# EAGLE design isoamp (EAGLE 9.6.2)
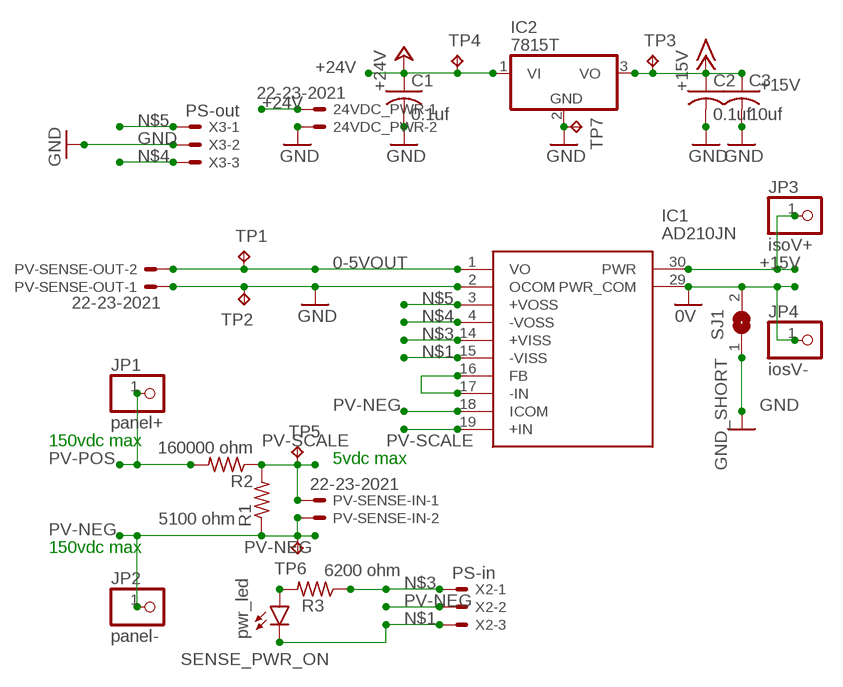
[diagram p0: schematic, sheet 1]

## Parts
24VDC_PWR  22-23-2021  [22-23-2021]
C1  0.1uf  C-USC1206  [C1206]
C2  0.1uf  C-USC1206  [C1206]
C3  10uf  C-USC1206  [C1206]
IC1  AD210JN  [AD210_N_12]
IC2  7815T  [TO220H]
JP1  panel+  PINHD-1X1  [1X01]
JP2  panel-  PINHD-1X1  [1X01]
JP3  isoV+  PINHD-1X1  [1X01]
JP4  iosV-  PINHD-1X1  [1X01]
PV-SENSE-IN  22-23-2021  [22-23-2021]
PV-SENSE-OUT  22-23-2021  [22-23-2021]
R1  5100 ohm  R-US_M1206  [M1206]
R2  160000 ohm  R-US_0204/7  [0204/7]
R3  6200 ohm  R-US_M1206  [M1206]
SENSE_PWR_ON  pwr_led  LEDCHIPLED_1206  [CHIPLED_1206]
SJ1  GND_SHORT  SJW  [SJW]
TP1  TPPAD1-13  [P1-13]
TP2  TPPAD1-13  [P1-13]
TP3  TPPAD1-13  [P1-13]
TP4  TPPAD1-13  [P1-13]
TP5  TPPAD1-13  [P1-13]
TP6  TPPAD1-13  [P1-13]
TP7  TPPAD1-13  [P1-13]
X2  PS-in  22-23-2031  [22-23-2031]
X3  PS-out  22-23-2031  [22-23-2031]

## Nets
0-5VOUT: IC1.1(VO) PV-SENSE-OUT.2 TP1.TP
0V: IC1.29(PWR_COM) JP4.1 SJ1.2
+15V: C2.1 C3.1 IC1.30(PWR) IC2.3(VO) JP3.1 TP3.TP
+24V: 24VDC_PWR.1 C1.1 IC2.1(VI) TP4.TP
GND: 24VDC_PWR.2 C1.2 C2.2 C3.2 IC1.2(OCOM) IC2.2(GND) PV-SENSE-OUT.1 SJ1.1 TP2.TP TP7.TP X3.2
N$1: IC1.15(-VISS) SENSE_PWR_ON.C X2.3
N$2: IC1.16(FB) IC1.17(-IN)
N$3: IC1.14(+VISS) R3.1 X2.1
N$4: IC1.4(-VOSS) X3.3
N$5: IC1.3(+VOSS) X3.1
N$6: R3.2 SENSE_PWR_ON.A
PV-NEG: IC1.18(ICOM) JP2.1 PV-SENSE-IN.2 R1.1 TP6.TP X2.2
PV-POS: JP1.1 R2.2
PV-SCALE: IC1.19(+IN) PV-SENSE-IN.1 R1.2 R2.1 TP5.TP

## Notes on the sheet
- 150vdc max
- 5vdc max
- 150vdc max

## Library data of the parts
24VDC_PWR PV-SENSE-IN PV-SENSE-OUT = con-molex:22-23-2021: .100" (2.54mm) Center Header - 2 Pin; MF: MOLEX; MPN: 22-23-2021; OC_FARNELL: 1462926; OC_NEWARK: 25C3832
C1-C3 = rcl:C-US: CAPACITOR, American symbol; SPICEPREFIX: C
IC1 = AD210JN:AD210JN: Precision, Wide Bandwidth 3-Port Isolation Amplifier Source: Datasheet; DESCRIPTION: Precision, Wide Bandwidth 3-Port Isolation Amplifier; HEIGHT: mm; MANUFACTURER_NAME: Analog Devices; MANUFACTURER_PART_NUMBER: AD210JN; MOUSER_PART_NUMBER: 584-AD210JN; MOUSER_PRICE-STOCK: https://www.mouser.co.uk/ProductDetail/Analog-Devices/AD210JN?qs=NmRFExCfTkFa6nj1j%252BgrMw%3D%3D
IC2 = linear:78*: Positive VOLTAGE REGULATOR Source: http://cache.national.com/ds/LM/LM78L05.pdf http://www.fairchildsemi.com/ds/LM/LM7805.pdf
JP1-JP4 = pinhead:PINHD-1X1: PIN HEADER
R1-R3 = rcl:R-US_: RESISTOR, American symbol; SPICEPREFIX: R
SENSE_PWR_ON = led:LED: LED OSRAM: - CHIPLED LG R971, LG N971, LY N971, LG Q971, LY Q971, LO R971, LY R971 LH N974, LH R974 LS Q976, LO Q976, LY Q976 LO Q996 - Hyper CHIPLED LW Q18S LB Q993, LB Q99A, LB R99A - SideLED LS A670, LO A670, LY A670, LG A670, LP A670 LB A673, LV A673, LT A673, LW A673 LH A674 LY A675 LS A676, LA A676, LO A676, LY A676, LW A676 LS A679, LY A679, LG A679 - Hyper Micro SIDELED® LS Y876, LA Y876, LO Y876, LY Y876 LT Y87S - SmartLED LW L88C, LW L88S LB L89C, LB L89S, LG L890 LS L89K, LO L89K, LY L89K LS L896, LA L896, LO L896, LY L896 - TOPLED LS T670, LO T670, LY T670, LG T670, LP T670 LSG T670, LSP T670, LSY T670, LOP T670, LYG T670 LG T671, LOG T671, LSG T671 LB T673, LV T673, LT T673, LW T673 LH T674 LS T676, LA T676, LO T676, LY T676, LB T676, LH T676, LSB T676, LW T676 LB T67C, LV T67C, LT T67C, LS T67K, LO T67K, LY T67K, LW E67C LS E67B, LA E67B, LO E67B, LY E67B, LB E67C, LV E67C, LT E67C LW T67C LS T679, LY T679, LG T679 LS T770, LO T770, LY T770, LG T770, LP T770 LB T773, LV T773, LT T773, LW T773 LH T774 LS E675, LA E675, LY E675, LS T675 LS T776, LA T776, LO T776, LY T776, LB T776 LHGB T686 LT T68C, LB T68C - Hyper Mini TOPLED® LB M676 - Mini TOPLED Santana® LG M470 LS M47K, LO M47K, LY M47K Source: http://www.osram.convergy.de LUXEON: - LUMILED® LXK2-PW12-R00, LXK2-PW12-S00, LXK2-PW14-U00, LXK2-PW14-V00 LXK2-PM12-R00, LXK2-PM12-S00, LXK2-PM14-U00 LXK2-PE12-Q00, LXK2-PE12-R00, LXK2-PE12-S00, LXK2-PE14-T00, LXK2-PE14-U00 LXK2-PB12-K00, LXK2-PB12-L00, LXK2-PB12-M00, LXK2-PB14-N00, LXK2-PB14-P00, LXK2-PB14-Q00 LXK2-PR12-L00, LXK2-PR12-M00, LXK2-PR14-Q00, LXK2-PR14-R00 LXK2-PD12-Q00, LXK2-PD12-R00, LXK2-PD12-S00 LXK2-PH12-R00, LXK2-PH12-S00 LXK2-PL12-P00, LXK2-PL12-Q00, LXK2-PL12-R00 Source: www.luxeon.com KINGBRIGHT: KA-3528ASYC Source: www.kingbright.com
SJ1 = jumper:SJ: SMD solder JUMPER
TP1-TP7 = testpad:TP: Test pad
X2 X3 = con-molex:22-23-2031: .100" (2.54mm) Center Header - 3 Pin; MF: MOLEX; MPN: 22-23-2031; OC_FARNELL: 1462950; OC_NEWARK: 30C0862

## Net classes
0 default: width 0.508 mm

## Board
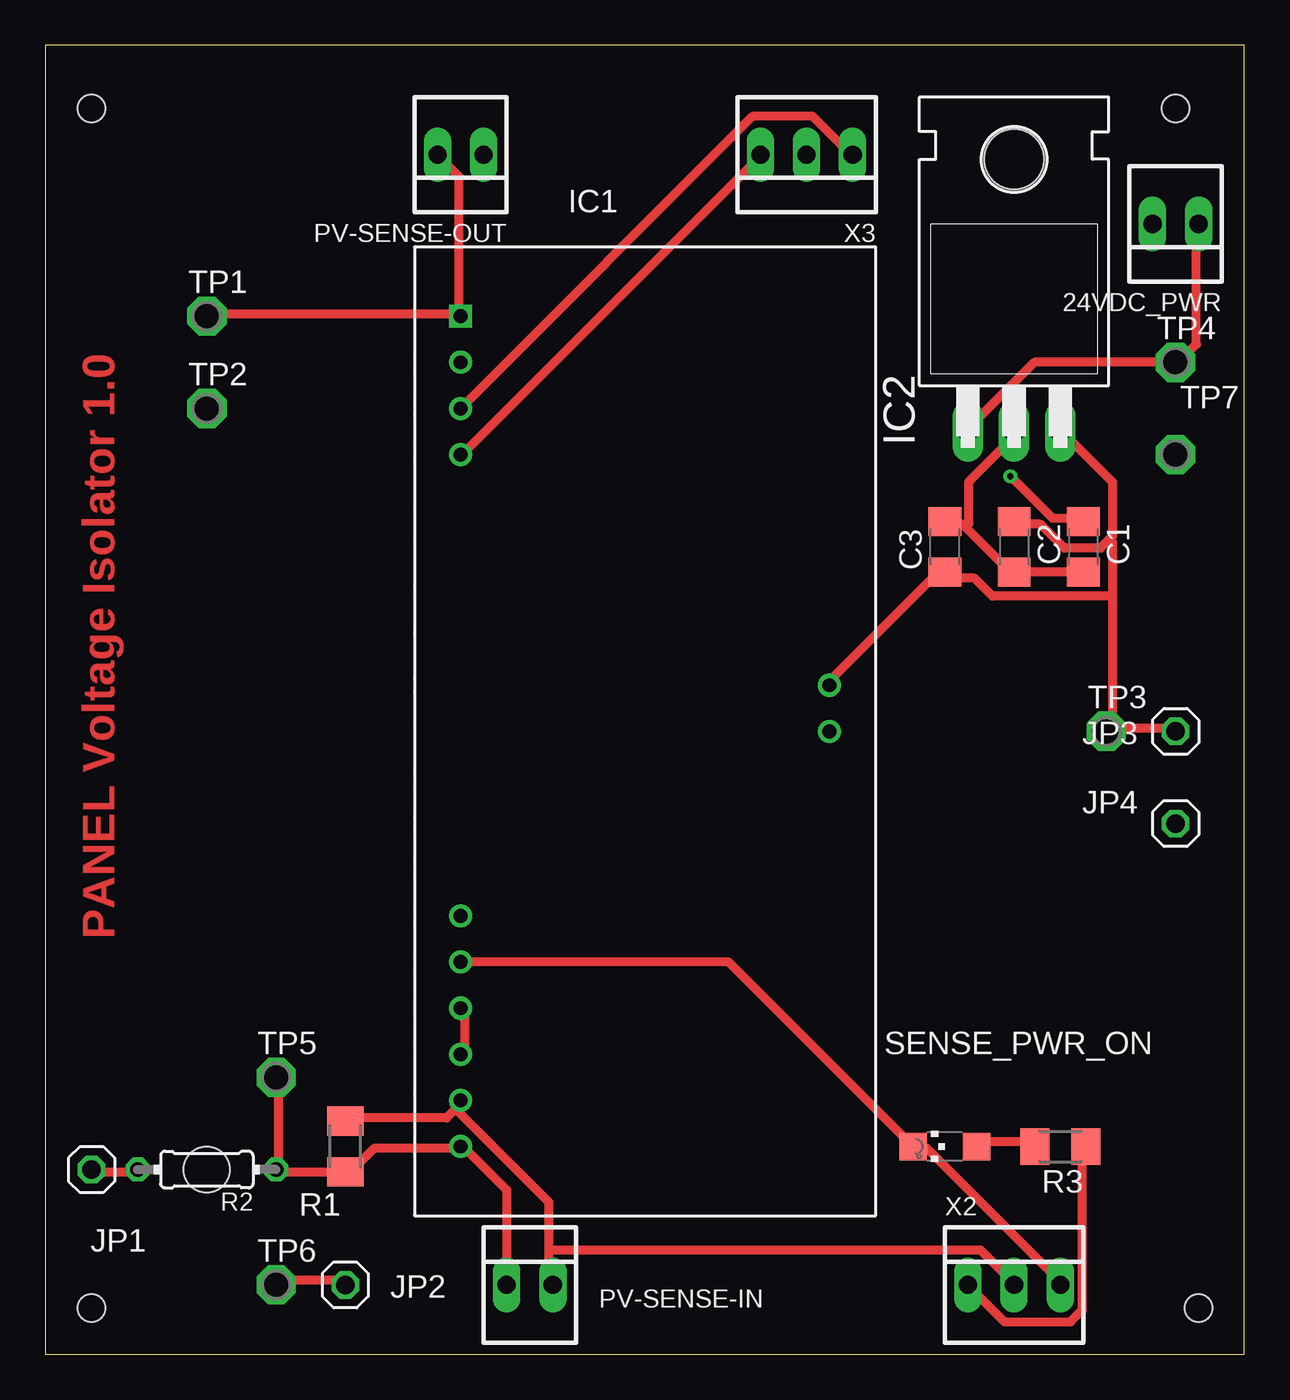
[diagram p1: board, top side]
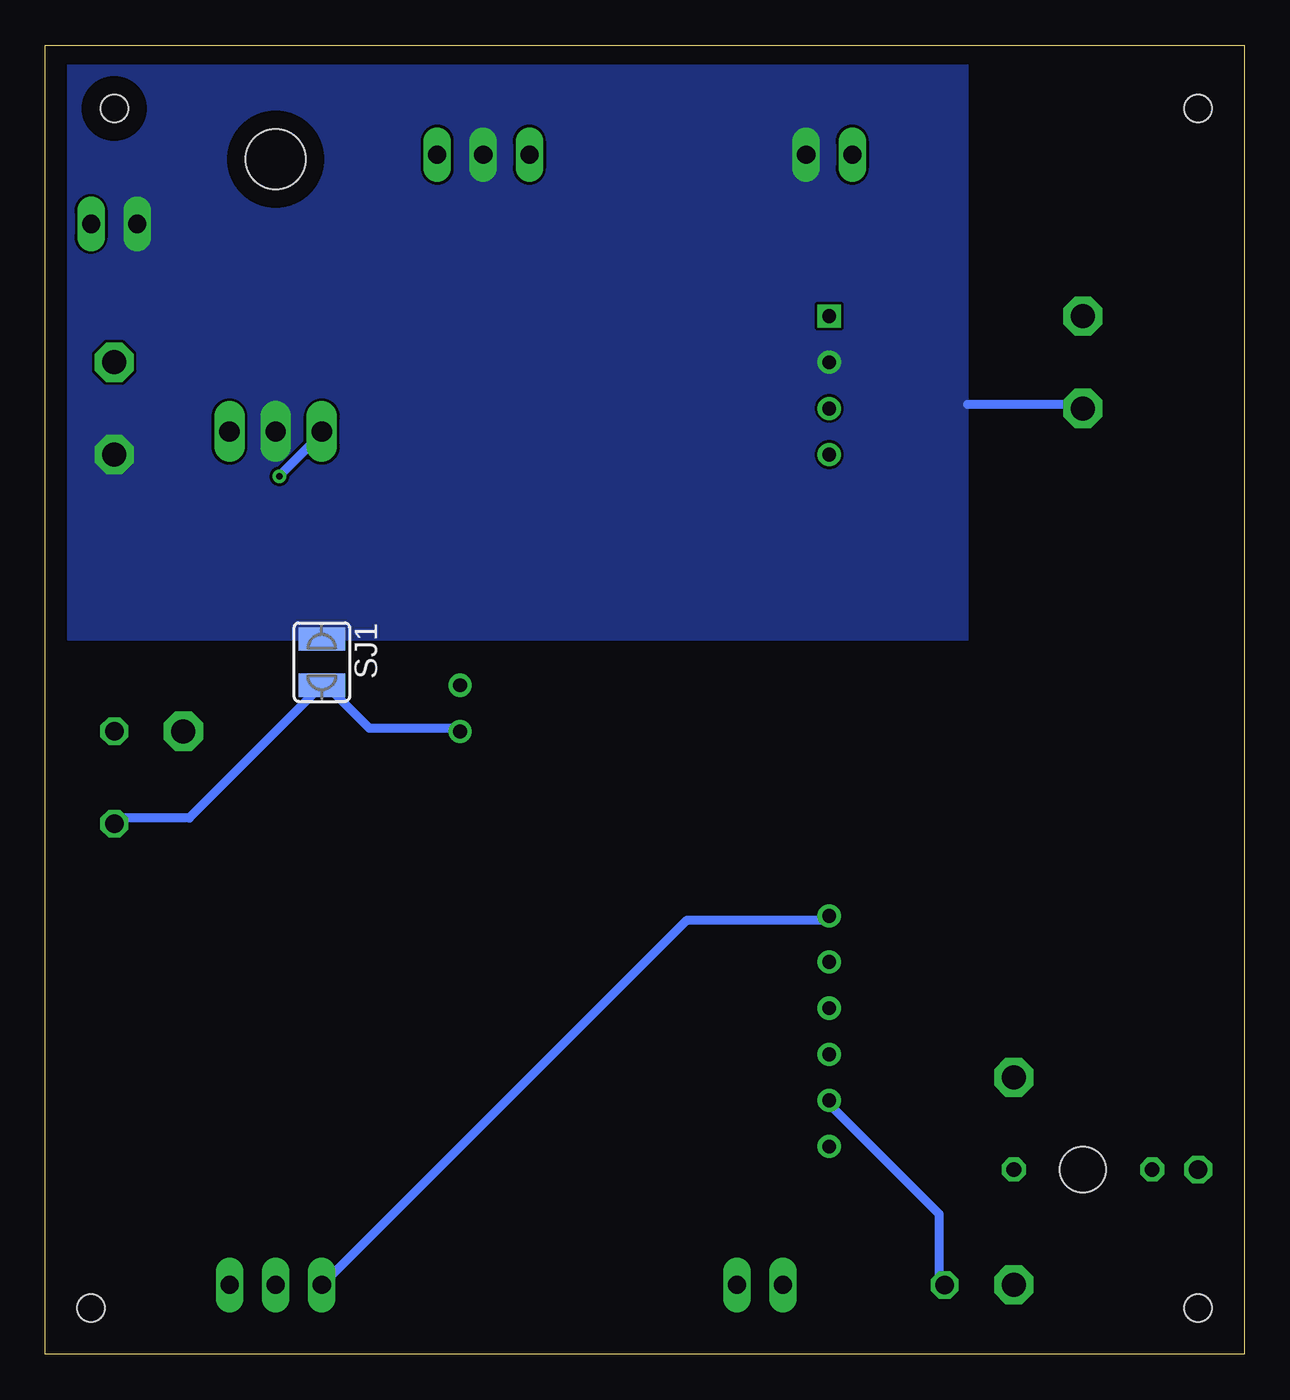
[diagram p2: board, bottom side, seen from below]

Size 66.02 x 72.06 mm. Coordinates in mm from the lower left corner, seen from the top.
Outline: 0,0 66.02,0 66.02,72.06 0,72.06 0,0
Copper layers (1*16): Top 0.035mm / dielectric 1.5mm / Bottom 0.035mm
Design rules "default": minimum track width 6mil, minimum drill 0.35mm, track to track 6mil, track to pad 6mil, pad to pad 6mil, via to via 6mil, smd to smd 6mil, copper to edge 40mil, drill to drill 6mil, minimum pad ring 10mil, minimum via ring 8mil, stop-mask expansion 4mil, vias tented up to drill 0mil, thermal gap 10mil
Holes 1.52 mm at 2.54,2.54 2.54,68.58 62.23,68.58 63.5,2.54
Holes 2.54 mm at 8.89,10.16

### Footprints (pad centres in the part's own frame; a part is rotated, then mirrored left to right if it is on the bottom)
22-23-2021 = drill 1 long: 1 -1.27,0; 2 1.27,0
C1206 = smd 1.6 x 1.8: 1 -1.4,0; 2 1.4,0
AD210_N_12 = drill 0.762 pad 1.143 square: 1 -20.32,45.72 | drill 0.762 pad 1.143: 2 -20.32,43.18; 3 -20.32,40.64; 4 -20.32,38.1; 14 -20.32,12.7; 15 -20.32,10.16; 16 -20.32,7.62; 17 -20.32,5.08; 18 -20.32,2.54; 19 -20.32,0; 29 0,22.86; 30 0,25.4
TO220H = drill 1.118 long: 1 -2.54,-10.16; 2 0,-10.16; 3 2.54,-10.16 | hole 3.302: 0,4.826
1X01 = drill 1.016 octagon: 1 0,0
M1206 = smd 1.6 x 2: 1 -1.4,0; 2 1.4,0
0204/7 = drill 0.813 octagon: 1 -3.81,0; 2 3.81,0
CHIPLED_1206 = smd 1.5 x 1.5: A 0,-1.75; C 0,1.75
SJW = smd 1.27 x 2.54: 1 -1.27,0; 2 1.27,0
P1-13 = drill 1.321 pad 2.159 octagon: TP 0,0
22-23-2031 = drill 1 long: 1 -2.54,0; 2 0,0; 3 2.54,0

### Placement (x,y rotation side)
24VDC_PWR  62.23,62.23 180 top
C1  57.15,44.45 270 top
C2  53.34,44.45 270 top
C3  49.53,44.45 90 top
IC1  43.18,11.43 0 top
IC2  53.34,60.96 0 top
JP1  2.54,10.16 0 top
JP2  16.51,3.81 0 top
JP3  62.23,34.29 0 top
JP4  62.23,29.21 0 top
PV-SENSE-IN  26.67,3.81 0 top
PV-SENSE-OUT  22.86,66.04 180 top
R1  16.51,11.43 270 top
R2  8.89,10.16 180 top
R3  55.88,11.43 180 top
SENSE_PWR_ON  49.53,11.43 90 top
SJ1  50.8,38.1 270 bottom
TP1  8.89,57.15 0 top
TP2  8.89,52.07 0 top
TP3  58.42,34.29 0 top
TP4  62.23,54.61 0 top
TP5  12.7,15.24 0 top
TP6  12.7,3.81 0 top
TP7  62.23,49.53 0 top
X2  53.34,3.81 0 top
X3  41.91,66.04 180 top

### Tracks (layer width: path | path; a pad name or v marks a point on that pad's centre or on a via)
0-5VOUT
  Top 0.508: 22.76,57.25 22.76,64.85 21.77,65.84 PV-SENSE-OUT.2 | 22.76,57.25 8.89,57.25 TP1.TP | 22.76,57.25 IC1.1
0V
  Bottom 0.508: IC1.29 43.23,34.47 48.18,34.47 50.5,36.78 SJ1.2 50.83,36.78 58.09,29.51 62.05,29.51 JP4.1
+15V
  Top 0.508: IC1.30 43.23,37.11 48.84,42.72 49.51,42.72 C3.1 49.84,42.72 51.16,42.72 52.15,41.73 58.75,41.73 | 58.75,34.47 58.42,34.47 TP3.TP 58.75,34.47 | 58.75,34.47 62.05,34.47 JP3.1 | 58.59,44.87 58.75,45.03 58.75,48.01 56.11,50.65 IC2.3 | 58.59,44.87 58.09,44.37 56.11,44.37 54.79,45.7 53.47,45.7 C2.1 | 58.75,41.73 58.75,44.7 58.59,44.87 | 58.75,41.73 58.75,34.47
+24V  (via drill 0.35)
  Top 0.508: v53.14,48.34 55.45,46.03 57.1,46.03 C1.1 | 24VDC_PWR.1 63.37,62.2 63.37,55.6 62.38,54.61 TP4.TP 54.46,54.61 50.83,50.98 IC2.1
  Bottom 0.508: v53.14,48.34 50.83,50.65 IC2.1
GND
  Top 0.508: C1.2 57.1,43.05 53.47,43.05 C2.2 53.14,43.05 50.66,45.53 | 50.66,45.53 50.5,45.7 49.84,45.7 C3.2 | 50.66,45.53 50.83,45.7 50.83,48.01 53.47,50.65 IC2.2
  Bottom 0.508: 15.24,52.3 8.89,52.3 TP2.TP
  pour Bottom (no thermals): 15.24,71.12 64.77,71.12 64.77,39.37 15.24,39.37
N$1
  Top 0.508: X2.3 55.78,4.09 48.51,11.35 47.85,11.35 SENSE_PWR_ON.C 47.52,11.68 37.62,21.59 IC1.15
N$2
  Top 0.508: IC1.17 23.09,16.64 23.09,18.95 IC1.16
N$3
  Top 0.508: R3.1 57.1,11.35 57.1,2.44 56.44,1.78 52.81,1.78 50.83,3.76 X2.1
  Bottom 0.508: IC1.14 23.09,23.9 30.68,23.9 50.5,4.09 X2.1
N$4
  Top 0.508: IC1.4 23.09,49.66 39.27,65.84 X3.3
N$5
  Top 0.508: IC1.3 38.94,68.15 42.24,68.15 44.22,66.17 X3.1
N$6
  Top 0.508: SENSE_PWR_ON.A 51.49,11.68 54.46,11.68 R3.2
PV-NEG
  Top 0.508: JP2.1 16.48,4.09 12.85,4.09 TP6.TP | 22.59,13.5 22.76,13.66 IC1.18 | 22.59,13.5 22.1,13 16.81,13 R1.1 | 27.71,5.74 27.71,8.38 22.59,13.5 | 27.71,5.74 27.71,4.09 PV-SENSE-IN.2 | 27.71,5.74 51.49,5.74 53.14,4.09 X2.2
  Bottom 0.508: JP2.1 16.81,4.09 16.81,7.72 22.76,13.66 IC1.18
PV-POS
  Top 0.508: R2.2 4.93,10.03 2.62,10.03 JP1.1
PV-SCALE
  Top 0.508: PV-SENSE-IN.1 25.4,9.04 23.09,11.35 IC1.19 22.76,11.35 18.14,11.35 16.81,10.03 R1.2 16.48,10.03 12.85,10.03 R2.1 12.85,10.36 12.85,14.99 TP5.TP

### Text on the board
Top: PANEL Voltage Isolator 1.0